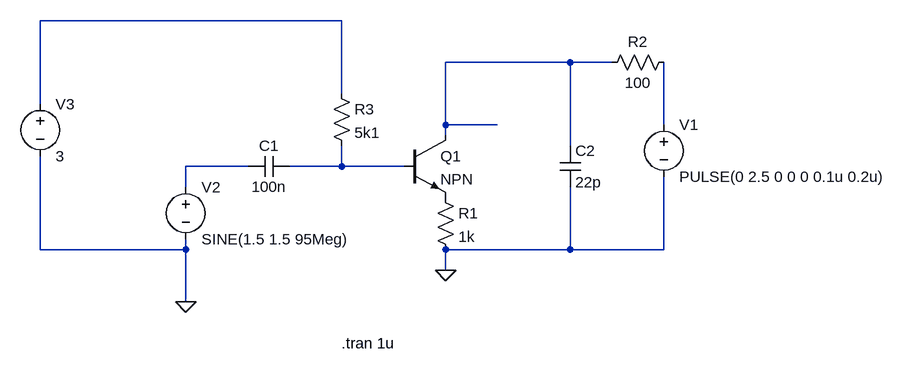
[diagram p0: schematic radio transmitter.asc]
radio transmitter.asc, the LTspice schematic file:
Version 4
SHEET 1 968 680
WIRE 80 -48 -384 -48
WIRE 432 16 240 16
WIRE 496 16 432 16
WIRE 80 64 80 -48
WIRE -384 80 -384 -48
WIRE 240 112 240 16
WIRE 320 112 240 112
WIRE 576 112 576 16
WIRE 240 128 240 112
WIRE 432 144 432 16
WIRE -64 176 -160 176
WIRE 80 176 80 144
WIRE 80 176 0 176
WIRE 176 176 80 176
WIRE -160 208 -160 176
WIRE -384 304 -384 160
WIRE -160 304 -160 288
WIRE -160 304 -384 304
WIRE 432 304 432 208
WIRE 432 304 240 304
WIRE 576 304 576 192
WIRE 576 304 432 304
WIRE 240 336 240 304
WIRE -160 384 -160 304
FLAG 240 336 0
FLAG -160 384 0
SYMBOL npn 176 128 R0
SYMATTR InstName Q1
SYMBOL voltage -160 192 R0
WINDOW 123 0 0 Left 0
WINDOW 39 0 0 Left 0
SYMATTR InstName V2
SYMATTR Value SINE(1.5 1.5 95Meg)
SYMBOL cap 0 160 R90
WINDOW 0 0 32 VBottom 2
WINDOW 3 32 32 VTop 2
SYMATTR InstName C1
SYMATTR Value 100n
SYMBOL res 224 208 R0
SYMATTR InstName R1
SYMATTR Value 1k
SYMBOL res 64 48 R0
SYMATTR InstName R3
SYMATTR Value 5k1
SYMBOL voltage -384 64 R0
WINDOW 123 0 0 Left 0
WINDOW 39 0 0 Left 0
SYMATTR InstName V3
SYMATTR Value 3
SYMBOL voltage 576 96 R0
WINDOW 123 0 0 Left 0
WINDOW 39 0 0 Left 0
SYMATTR InstName V1
SYMATTR Value PULSE(0 2.5 0 0 0 0.1u 0.2u)
SYMBOL res 592 0 R90
WINDOW 0 0 56 VBottom 2
WINDOW 3 32 56 VTop 2
SYMATTR InstName R2
SYMATTR Value 100
SYMBOL cap 416 144 R0
SYMATTR InstName C2
SYMATTR Value 22p
TEXT 80 448 Left 2 !.tran 1u

The netlist it stands for:
* radio transmitter.asc
Q1 N002 N005 P001 0 NPN
V2 N004 0 SINE(1.5 1.5 95Meg)
C1 N005 N004 100n
R1 P001 0 1k
R3 N001 N005 5k1
V3 N001 0 3
V1 N003 0 PULSE(0 2.5 0 0 0 0.1u 0.2u)
R2 N003 N002 100
C2 N002 0 22p
.model NPN NPN
.model PNP PNP
.lib standard.bjt
.tran 1u
.backanno
.end